# Altium schematic sheet belt_motor_control.SchDoc
size A3; DocumentNumber: 5; Revision: V1.0; SheetNumber: 5; SheetTotal: 9
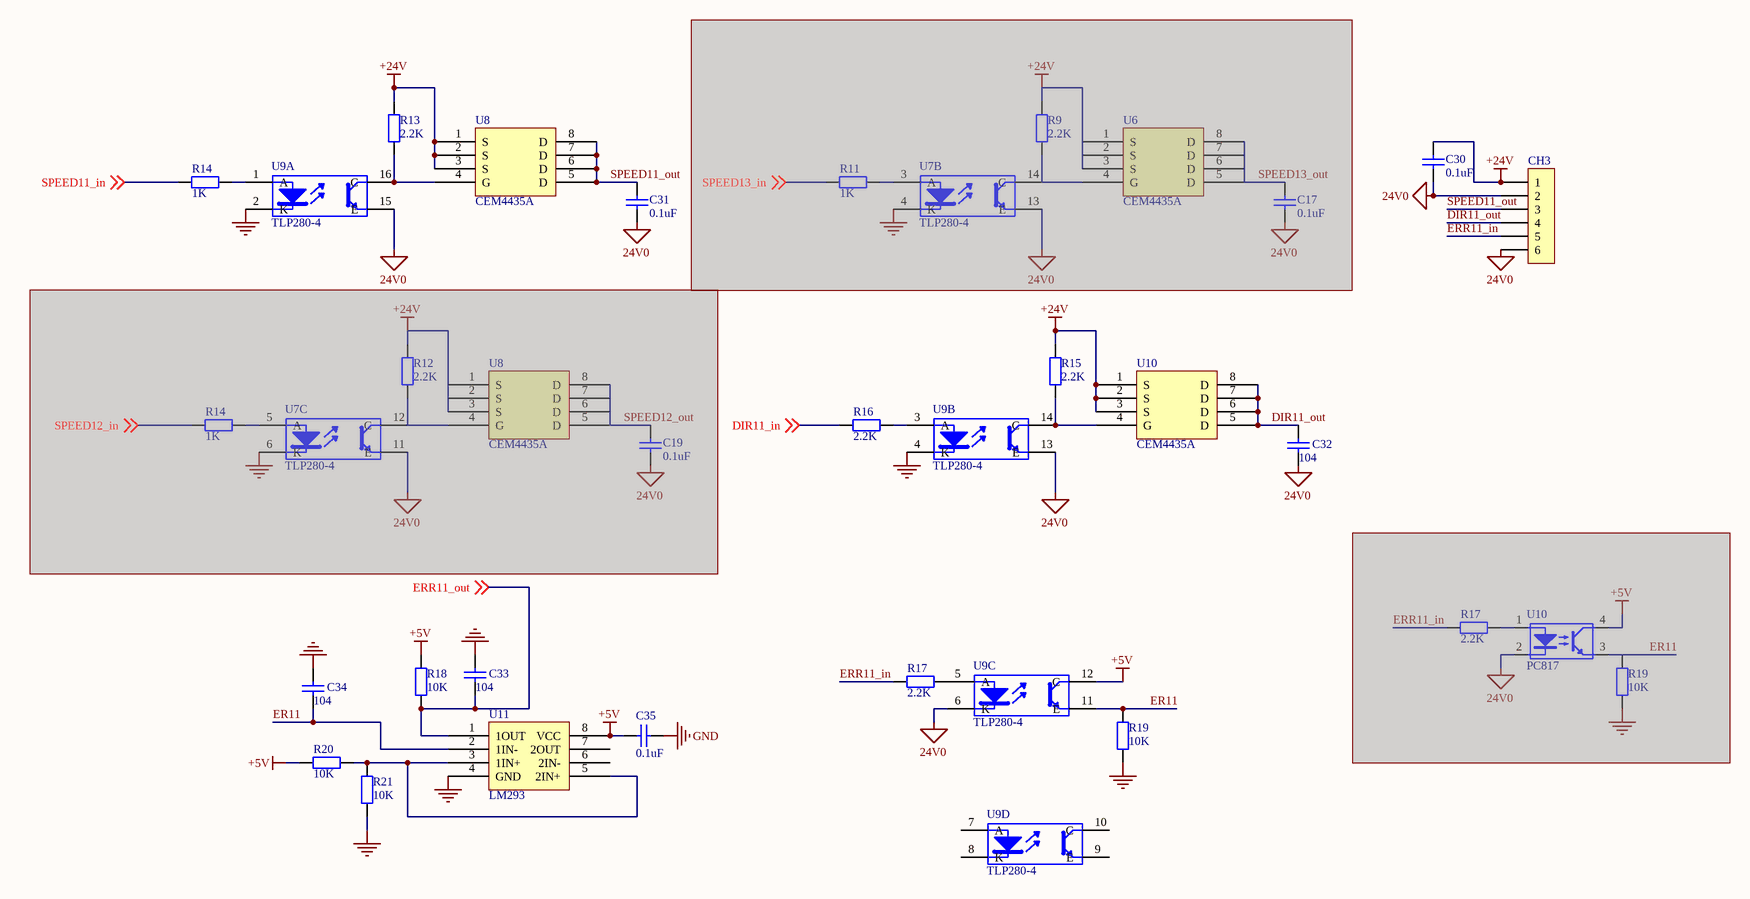
[diagram p0: belt_motor_control.SchDoc]

## Parts
(Parts that share a designator on the sheet are numbered #1, #2 ... from top to bottom, then left to right.)
C17  value 0.1uF  [0805]  (hidden comment: Cap)  (masked out: inside a compile mask, not in the netlist)
C19  value 0.1uF  [0805]  (hidden comment: Cap)  (masked out: inside a compile mask, not in the netlist)
C30  value 0.1uF  [0805]  (hidden comment: Cap)
C31  value 0.1uF  [0805]  (hidden comment: Cap)
C32  value 104  [0805]  (hidden comment: Cap)
C33  value 104  [0805]  (hidden comment: Cap)
C34  value 104  [0805]  (hidden comment: Cap)
C35  value 0.1uF  [0805]  (hidden comment: Cap)
CH3  HEADER1X6  [CH3.96-6PIN]  (value not drawn)
R9  value 2.2K  [0805]  (hidden comment: Res2)  (masked out: inside a compile mask, not in the netlist)
R11  value 1K  [0805]  (hidden comment: Res2)  (masked out: inside a compile mask, not in the netlist)
R12  value 2.2K  [0805]  (hidden comment: Res2)  (masked out: inside a compile mask, not in the netlist)
R13  value 2.2K  [0805]  (hidden comment: Res2)
R14#1  value 1K  [0805]  (hidden comment: Res2)
R14#2  value 1K  [0805]  (hidden comment: Res2)  (masked out: inside a compile mask, not in the netlist)
R15  value 2.2K  [0805]  (hidden comment: Res2)
R16  value 2.2K  [0805]  (hidden comment: Res2)
R17#1  value 2.2K  [0805]  (hidden comment: Res2)  (masked out: inside a compile mask, not in the netlist)
R17#2  value 2.2K  [0805]  (hidden comment: Res2)
R18  value 10K  [0805]  (hidden comment: Res2)
R19#1  value 10K  [0805]  (hidden comment: Res2)  (masked out: inside a compile mask, not in the netlist)
R19#2  value 10K  [0805]  (hidden comment: Res2)
R20  value 10K  [0805]  (hidden comment: Res2)
R21  value 10K  [0805]  (hidden comment: Res2)
U6  CEM4435A  [SOP8-OP27]  (masked out: inside a compile mask, not in the netlist)
U7  TLP280-4  [SO16]  (parts B,C of 4)  (masked out: inside a compile mask, not in the netlist)
U8#1  CEM4435A  [SOP8-OP27]
U8#2  CEM4435A  [SOP8-OP27]  (masked out: inside a compile mask, not in the netlist)
U9  TLP280-4  [SO16]  (parts A,B,C,D of 4)
U10#1  CEM4435A  [SOP8-OP27]
U10#2  PC817  [SOP4_127]  (masked out: inside a compile mask, not in the netlist)
U11  LM293  [SOP8-OP27]

## Nets
24V0: C30.2 C31.2 C32.1 CH3.2 CH3.6 U9.6(K) U9.13(E) U9.15(E)
+5V: C35.2 R18.1 R20.1 U9.12(C) U11.8(VCC)
+24V: C30.1 CH3.1 R13.2 R15.1 U8#1.1(S) U8#1.2(S) U8#1.3(S) U10#1.1(S) U10#1.2(S) U10#1.3(S)
GND: C33.2 C34.2 C35.1 R19#2.1 R21.2 U9.2(K) U9.4(K) U11.4(GND)
DIR11_in: R16.1 ; off-sheet DIR11_in
DIR11_out: C32.2 CH3.4 U10#1.5(D) U10#1.6(D) U10#1.7(D) U10#1.8(D)
ER11: C34.1 R19#2.2 U9.11(E) U11.2(1IN-)
ERR11_in: CH3.5 R17#2.1
ERR11_out: C33.1 R18.2 U11.1(1OUT) ; off-sheet ERR11_out
SPEED11_in: R14#1.1 ; off-sheet SPEED11_in
SPEED11_out: C31.1 CH3.3 U8#1.5(D) U8#1.6(D) U8#1.7(D) U8#1.8(D)
NetR13_1: R13.1 U8#1.4(G) U9.16(C)
NetR14#1_2: R14#1.2 U9.1(A)
NetR15_2: R15.2 U9.14(C) U10#1.4(G)
NetR16_2: R16.2 U9.3(A)
NetR17#2_2: R17#2.2 U9.5(A)
NetR20_2: R20.2 R21.1 U11.3(1IN+) U11.5(2IN+)

Not connected (* = marked no-connect by the designer): U9 7(A) 8(K) 9(E) 10(C); U11 6(2IN-) 7(2OUT)

## Notes on the sheet
- :

## Library data of the parts
C17 C19 C30-C35 = Cap: Capacitor; Published: 8-Jun-2000; LatestRevisionDate: 17-Jul-2002; LatestRevisionNote: Re-released for DXP Platform.; PackageReference: RAD-0.3; Publisher: Altium Limited
R9 R11-R13 R14#1 R14#2 R15 R16 R17#1 R17#2 R18 R19#1 R19#2 R20 R21 = Res2: Resistor; Published: 8-Jun-2000; LatestRevisionDate: 17-Jul-2002; LatestRevisionNote: Re-released for DXP Platform.; PackageReference: AXIAL-0.4; Publisher: Altium Limited
U7 U9 = TLP521-4